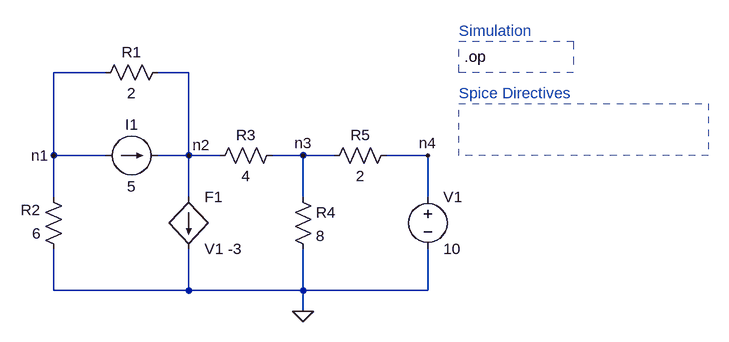
[diagram p0: schematic CCCS_f.asc]
CCCS_f.asc, the LTspice schematic file:
Version 4
SHEET 1 1432 696
WIRE 96 112 16 112
WIRE 224 112 176 112
WIRE 16 240 16 112
WIRE 96 240 16 240
WIRE 224 240 224 112
WIRE 224 240 176 240
WIRE 272 240 224 240
WIRE 400 240 352 240
WIRE 448 240 400 240
WIRE 592 240 528 240
WIRE 16 304 16 240
WIRE 224 304 224 240
WIRE 400 304 400 240
WIRE 592 304 592 240
WIRE 16 448 16 384
WIRE 224 448 224 384
WIRE 224 448 16 448
WIRE 400 448 400 384
WIRE 400 448 224 448
WIRE 592 448 592 384
WIRE 592 448 400 448
WIRE 400 480 400 448
FLAG 400 480 0
FLAG 16 240 n1
FLAG 224 240 n2
FLAG 400 240 n3
FLAG 592 240 n4
SYMBOL f 224 304 R0
SYMATTR InstName F1
SYMATTR Value V1 -3
SYMBOL current 96 240 R270
WINDOW 0 32 40 VTop 2
WINDOW 3 -32 40 VBottom 2
SYMATTR InstName I1
SYMATTR Value 5
SYMBOL voltage 592 288 R0
SYMATTR InstName V1
SYMATTR Value 10
SYMBOL res 192 96 R90
WINDOW 0 0 56 VBottom 2
WINDOW 3 32 56 VTop 2
SYMATTR InstName R1
SYMATTR Value 2
SYMBOL res 32 400 R180
WINDOW 0 36 76 Left 2
WINDOW 3 36 40 Left 2
SYMATTR InstName R2
SYMATTR Value 6
SYMBOL res 256 256 R270
WINDOW 0 32 56 VTop 2
WINDOW 3 0 56 VBottom 2
SYMATTR InstName R3
SYMATTR Value 4
SYMBOL res 384 288 R0
SYMATTR InstName R4
SYMATTR Value 8
SYMBOL res 544 224 R90
WINDOW 0 0 56 VBottom 2
WINDOW 3 32 56 VTop 2
SYMATTR InstName R5
SYMATTR Value 2
TEXT 640 48 Left 2 ;Simulation
TEXT 648 88 Left 2 !.op
TEXT 640 144 Left 2 ;Spice Directives
RECTANGLE Normal 816 112 640 64 2
RECTANGLE Normal 1024 240 640 160 2

The netlist it stands for:
* CCCS_f.asc
F1 n2 0 V1 -3
I1 n1 n2 5
V1 n4 0 10
R1 n2 n1 2
R2 0 n1 6
R3 n2 n3 4
R4 n3 0 8
R5 n4 n3 2
* Simulation
.op
* Spice Directives
.backanno
.end